# EAGLE design placa_v1 (EAGLE 7.3.0)
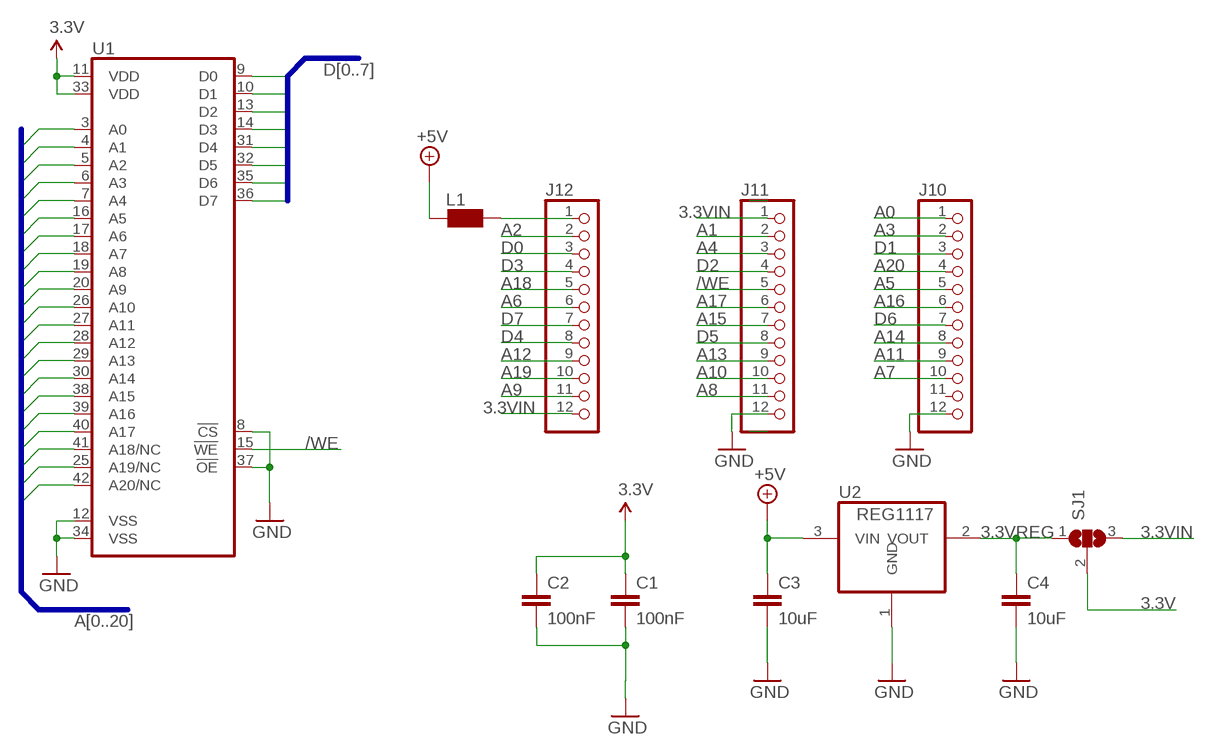
[diagram p0: schematic, sheet 1]

## Parts
C1  100nF  C-EUC0805K  [C0805K]
C2  100nF  C-EUC0805K  [C0805K]
C3  10uF  C-EUC0805K  [C0805K]
C4  10uF  C-EUC0805K  [C0805K]
J10  PINHD-1X12  [1X12]
J11  PINHD-1X12  [1X12]
J12  PINHD-1X12  [1X12]
L1  WE-CBF_0805  [0805]
SJ1  SJ2W  [SJ_2]
U1  ISSI_SRAM_8BIT  [TSOP44-II]
U2  REG1117  [SOT223]

## Nets
3.3V [power]: C1.1 C2.1 SJ1.2 U1.11(VDD) U1.33(VDD)
3.3VIN [power]: J11.1 J12.12 SJ1.3
3.3VREG [power]: C4.1 SJ1.1 U2.2(VOUT)
+5V [power]: C3.1 L1.2 U2.3(VIN)
/WE: J11.5 U1.15(!WE)
A0: J10.1 U1.3(A0)
A1: J11.2 U1.4(A1)
A2: J12.2 U1.5(A2)
A3: J10.2 U1.6(A3)
A4: J11.3 U1.7(A4)
A5: J10.5 U1.16(A5)
A6: J12.6 U1.17(A6)
A7: J10.10 U1.18(A7)
A8: J11.11 U1.19(A8)
A9: J12.11 U1.20(A9)
A10: J11.10 U1.26(A10)
A11: J10.9 U1.27(A11)
A12: J12.9 U1.28(A12)
A13: J11.9 U1.29(A13)
A14: J10.8 U1.30(A14)
A15: J11.7 U1.38(A15)
A16: J10.6 U1.39(A16)
A17: J11.6 U1.40(A17)
A18: J12.5 U1.41(A18/NC)
A19: J12.10 U1.25(A19/NC)
A20: J10.4 U1.42(A20/NC)
D0: J12.3 U1.9(D0)
D1: J10.3 U1.10(D1)
D2: J11.4 U1.13(D2)
D3: J12.4 U1.14(D3)
D4: J12.8 U1.31(D4)
D5: J11.8 U1.32(D5)
D6: J10.7 U1.35(D6)
D7: J12.7 U1.36(D7)
GND [power]: C1.2 C2.2 C3.2 C4.2 J10.12 J11.12 U1.8(!CS) U1.12(VSS) U1.34(VSS) U1.37(!OE) U2.1(GND)
N$1 [power]: J12.1 L1.1
Unconnected: J10.11

## Buses
A[0..20]
D[0..7]

## Library data of the parts
C1-C4 = rcl:C-EU: CAPACITOR, European symbol
J10-J12 = pinhead:PINHD-1X12: PIN HEADER
L1 = wuerth-elektronik:WE-CBF: SMD EMI Suppression Ferrite Beads - excellent anti-EMI properties - low DCR - impedances till 3000 ohms - rated current up to 6 A
SJ1 = jumper:SJ2W: SMD solder JUMPER
U1 = GadgetFactory:ISSI_SRAM_8BIT
U2 = burr-brown:REG1117: 800mA and 1A Low Dropout (LDO) Positive Regulator 1.8V, 2.5V, 2.85V, 3.3V, 5V, and Adj

## Net classes
0 default: width 0.203 mm, clearance 0.203 mm
1 power: width 0.406 mm, clearance 0.203 mm to class 0, clearance 0.203 mm

## Board
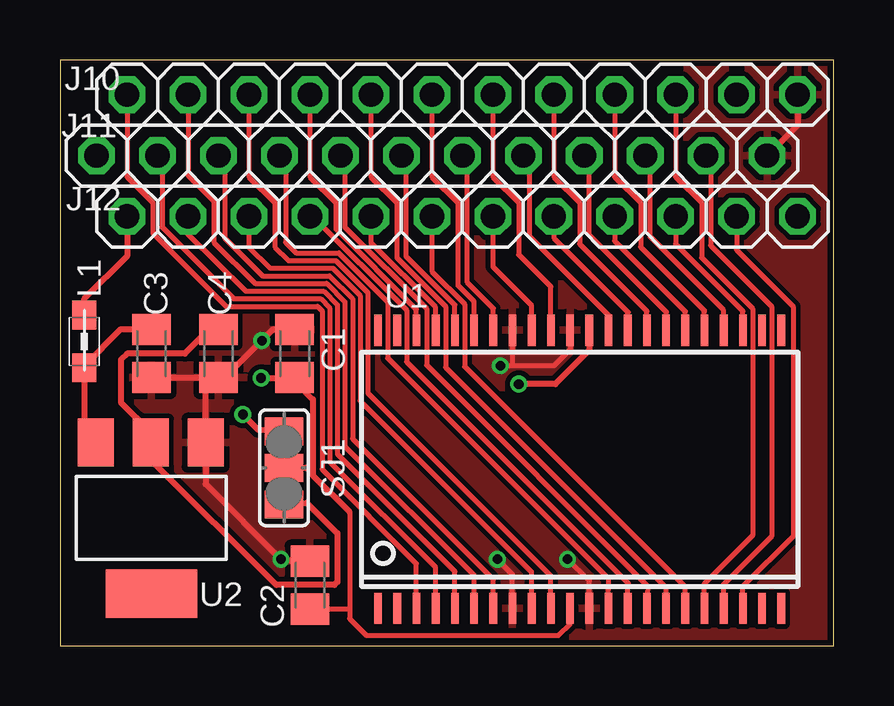
[diagram p1: board, top side]
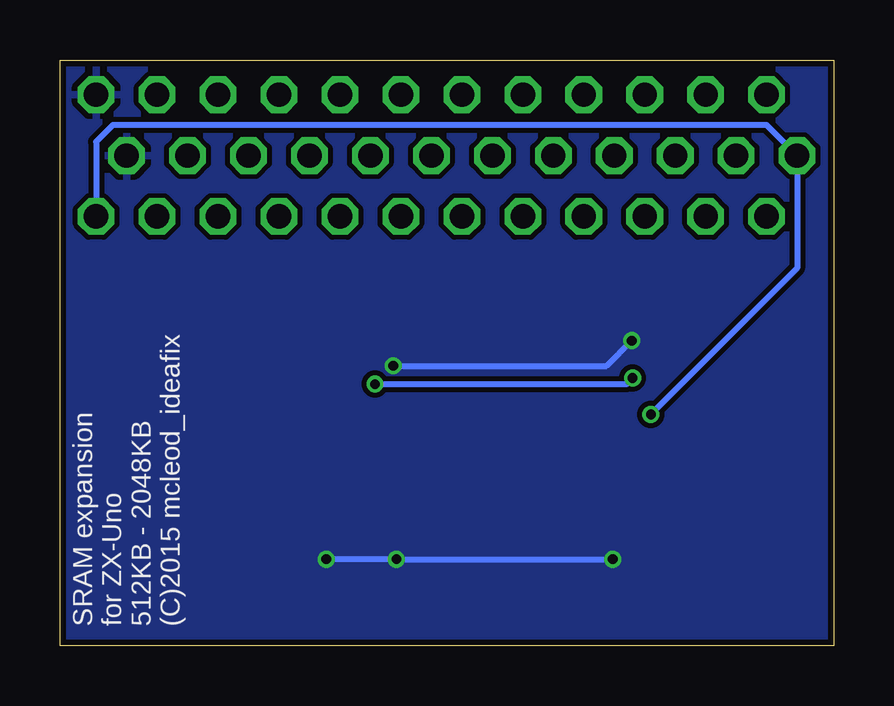
[diagram p2: board, bottom side, seen from below]

Size 32.24 x 24.43 mm. Coordinates in mm from the lower left corner, seen from the top.
Outline: 0,0 32.24,0 32.24,24.43 0,24.43 0,0
Copper layers (1*16): Top 0.035mm / dielectric 1.5mm / Bottom 0.035mm
Design rules "seedstudio_Fusion_eagle_rule_v1.1": minimum track width 6mil, minimum drill 12mil, track to track 6mil, track to pad 6mil, pad to pad 6mil, via to via 6mil, smd to smd 0mil, copper to edge 10mil, drill to drill 10mil, minimum pad ring 10mil, minimum via ring 6mil, stop-mask expansion 2mil, vias tented up to drill 100mil, thermal gap 10mil

### Footprints (pad centres in the part's own frame; a part is rotated, then mirrored left to right if it is on the bottom)
C0805K = smd 1.3 x 1.6: 1 -1,0; 2 1,0
1X12 = drill 1.016 octagon: 1 -13.97,0; 2 -11.43,0; 3 -8.89,0; 4 -6.35,0; 5 -3.81,0; 6 -1.27,0; 7 1.27,0; 8 3.81,0; 9 6.35,0; 10 8.89,0; 11 11.43,0; 12 13.97,0
0805 = smd 1.2 x 1: 1 -1.1,0; 2 1.1,0
SJ_2 = smd 1.168 x 1.6: 1 -1.524,0; 2 0,0; 3 1.524,0
TSOP44-II = smd 0.32 x 1.3: 1 -8.4,-5.8; 2 -7.6,-5.8; 3 -6.8,-5.8; 4 -6,-5.8; 5 -5.2,-5.8; 6 -4.4,-5.8; 7 -3.6,-5.8; 8 -2.8,-5.8; 9 -2,-5.8; 10 -1.2,-5.8; 11 -0.4,-5.8; 12 0.4,-5.8; 13 1.2,-5.8; 14 2,-5.8; 15 2.8,-5.8; 16 3.6,-5.8; 17 4.4,-5.8; 18 5.2,-5.8; 19 6,-5.8; 20 6.8,-5.8; 21 7.6,-5.8; 22 8.4,-5.8; 23 8.4,5.8; 24 7.6,5.8; 25 6.8,5.8; 26 6,5.8; 27 5.2,5.8; 28 4.4,5.8; 29 3.6,5.8; 30 2.8,5.8; 31 2,5.8; 32 1.2,5.8; 33 0.4,5.8; 34 -0.4,5.8; 35 -1.2,5.8; 36 -2,5.8; 37 -2.8,5.8; 38 -3.6,5.8; 39 -4.4,5.8; 40 -5.2,5.8; 41 -6,5.8; 42 -6.8,5.8; 43 -7.6,5.8; 44 -8.4,5.8
SOT223 = smd 1.499 x 2.007: 1 -2.261,-3.15; 2 0.025,-3.15; 3 2.311,-3.15 | smd 3.81 x 2.007: 4 0,3.15

### Placement (x,y rotation side)
C1  9.78,12.19 90 top
C2  10.41,2.54 90 top
C3  3.81,12.19 270 top
C4  6.6,12.19 270 top
J10  16.76,22.99 0 top
J11  15.49,20.45 0 top
J12  16.76,17.91 0 top
L1  1.02,12.7 270 top
SJ1  9.33,7.43 90 top
U1  21.65,7.37 0 top
U2  3.81,5.33 180 top

### Tracks (layer width: path | path; a pad name or v marks a point on that pad's centre or on a via)
3.3V  (via drill 0.4)
  Top 0.203: SJ1.2 10.22,7.43 | 12.06,5.59 12.06,1.52 | 12.06,1.52 12.06,1.14 12.76,0.45 20.77,0.45 21.27,0.95 21.27,1.55 U1.11 | C2.1 12.05,1.54 12.06,1.52
  Top 0.254: 10.54,7.43 10.54,10.29 9.78,11.05 C1.1 9.76,11.18 v8.38,11.18 | 10.54,7.43 10.54,7.11 12.06,5.59 | 10.22,7.43 10.54,7.43 | U1.33 22.05,12.34 20.64,10.92 v19.11,10.92
  Bottom 0.254: v19.11,10.92 8.64,10.92 v8.38,11.18
3.3VIN  (via drill 0.4)
  Top 0.254: SJ1.3 8.26,9.02 v7.62,9.65
  Bottom 0.254: J12.12 30.73,21.02 30.04,21.72 2.79,21.72 J11.1 1.52,15.75 v7.62,9.65
3.3VREG
  Top 0.254: C4.1 6.21,13.19 5.21,12.19 2.79,12.19 2.54,11.94 2.54,10.16 3.79,8.91 U2.2 3.81,8.46 3.81,7.75 9.02,2.54 11.43,2.54 11.56,2.67 11.56,4.7 10.29,5.97 SJ1.1
+5V
  Top 0.254: C3.1 3.79,13.21 2.54,13.21 1.02,11.68 L1.2 1.02,8.97 U2.3
/WE
  Top 0.203: J11.5 11.87,20.26 11.87,17.46 15.27,14.06 15.27,11.72 24.52,2.47 U1.15
A0
  Top 0.203: J10.1 2.79,19.56 3.87,18.48 3.87,17.21 6.92,14.16 10.73,14.16 10.92,13.97 10.92,7.37 14.85,3.43 U1.3
A1
  Top 0.203: J11.2 4.25,20.19 4.25,17.46 7.24,14.48 10.86,14.48 11.24,14.1 11.24,7.68 15.65,3.27 U1.4
A2
  Top 0.203: J12.2 5.33,17.14 7.75,14.8 10.99,14.8 11.56,14.22 11.56,8 16.45,3.1 U1.5
A3
  Top 0.203: J10.2 5.33,19.62 6.41,18.54 6.41,16.83 8.13,15.11 11.11,15.11 11.87,14.35 11.87,8.32 17.25,2.94 U1.6
A4
  Top 0.203: J11.3 6.86,20.19 6.86,17.02 8.45,15.43 11.24,15.43 12.19,14.48 12.19,8.64 18.05,2.77 U1.7
A5
  Top 0.203: J10.5 12.95,19.56 14.03,18.48 14.03,16.19 16.07,14.16 16.07,11.62 25.27,2.41 25.25,2.39 U1.16
A6
  Top 0.203: J12.6 15.49,15.62 16.86,14.26 16.86,11.65 26.05,2.46 U1.17
A7
  Top 0.203: J10.10 25.65,19.56 26.73,18.48 26.73,16.19 28.86,14.06 28.86,4.6 26.85,2.6 U1.18
A8
  Top 0.203: J11.11 27.11,20.26 27.11,16.7 29.65,14.16 29.65,4.57 27.65,2.57 U1.19
A9
  Top 0.203: J12.11 28.19,16.51 30.54,14.16 30.54,4.57 28.45,2.48 U1.20
A10
  Top 0.203: J11.10 24.57,20.26 24.57,17.08 27.65,14 U1.26
A11
  Top 0.203: J10.9 23.11,19.56 24.19,18.48 24.19,16.64 26.86,13.97 26.85,13.96 U1.27
A12
  Top 0.203: J12.9 23.11,16.89 26.05,13.95 U1.28
A13
  Top 0.203: J11.9 22.04,20.26 22.04,17.14 25.27,13.91 25.25,13.89 U1.29
A14
  Top 0.203: J10.8 20.57,19.56 21.65,18.48 21.65,16.76 24.45,13.96 U1.30
A15
  Top 0.203: J11.7 16.95,20.26 16.95,15.18 18.05,14.08 U1.38
A16
  Top 0.203: J10.6 15.49,19.56 16.57,18.48 16.57,15.05 17.25,14.37 U1.39
A17
  Top 0.203: J11.6 14.41,20.26 14.41,16.26 16.45,14.22 U1.40
A18
  Top 0.203: J12.5 12.95,16.83 15.65,14.13 U1.41
A19
  Top 0.203: J12.10 25.65,16.76 28.45,13.96 U1.25
A20
  Top 0.203: J10.4 10.41,19.56 11.49,18.48 11.49,17.4 14.85,14.04 U1.42
D0
  Top 0.203: J12.3 7.87,16.64 8.76,15.75 11.37,15.75 12.51,14.61 12.51,10.22 19.65,3.08 U1.9
D1
  Top 0.203: J10.3 7.87,19.56 8.95,18.48 8.95,16.64 9.53,16.07 11.49,16.07 12.83,14.73 12.83,10.54 20.45,2.91 U1.10
D2
  Top 0.203: J11.4 9.21,20.45 9.4,20.26 9.4,16.83 9.84,16.38 11.62,16.38 13.65,14.35 13.65,12 22.86,2.79 22.85,2.34 U1.13
D3
  Top 0.203: J12.4 10.54,17.91 14.45,14 14.45,11.84 23.69,2.6 23.65,2.38 U1.14
D4
  Top 0.203: U1.31 23.65,13.87 23.69,13.91 20.57,17.02 J12.8
D5
  Top 0.203: J11.8 19.56,20.19 19.56,17.08 22.86,13.78 22.85,13.77 U1.32
D6
  Top 0.203: J10.7 18.03,19.56 19.11,18.48 19.11,16.32 20.45,14.98 U1.35
D7
  Top 0.203: J12.7 18.03,15.81 19.65,14.19 U1.36
GND  (via drill 0.4)
  Top 0.203: U1.34 21.25,12.36 20.57,11.68 18.86,11.68 | 18.86,11.68 v18.35,11.68 | U1.37 18.85,11.69 18.86,11.68 | U1.12 22.05,2.71 v21.14,3.62 | v18.22,3.62 18.85,2.99 U1.8
  Top 0.254: C3.2 6.1,11.19 | 6.1,11.19 C4.2 6.87,11.19 v8.41,12.73 8.89,13.21 8.91,13.19 C1.2 | 6.1,11.19 6.07,11.17 U2.1 6.07,6.76 v9.21,3.62 9.27,3.56 10.4,3.56 C2.2 | J10.12 30.73,21.72 J11.12
  Bottom 0.254: v18.22,3.62 v21.14,3.62 | v18.22,3.62 v9.21,3.62 | 18.16,3.68 v18.22,3.62 | v18.35,11.68 9.46,11.68 v8.41,12.73
  pour Bottom: 0,24.51 32.26,24.51 32.26,0 0,0
  pour Top: 0,24.51 32.26,24.51 32.26,0 0,0
N$1
  Top 0.254: L1.1 1.02,14.48 2.79,16.26 J12.1

### Text on the board
bNames: SRAM expansion / for ZX-Uno / 512KB - 2048KB / (C)2015 mcleod_ideafix